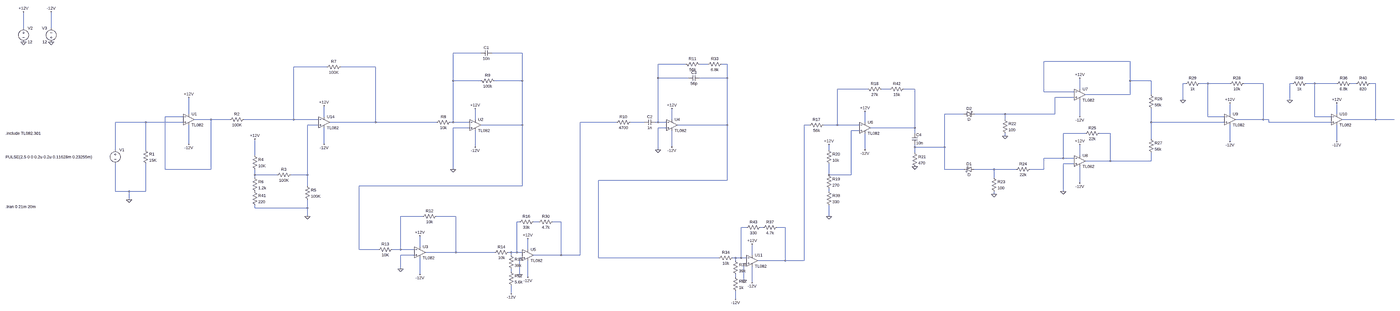
[diagram p0: schematic tp2.asc, whole sheet]
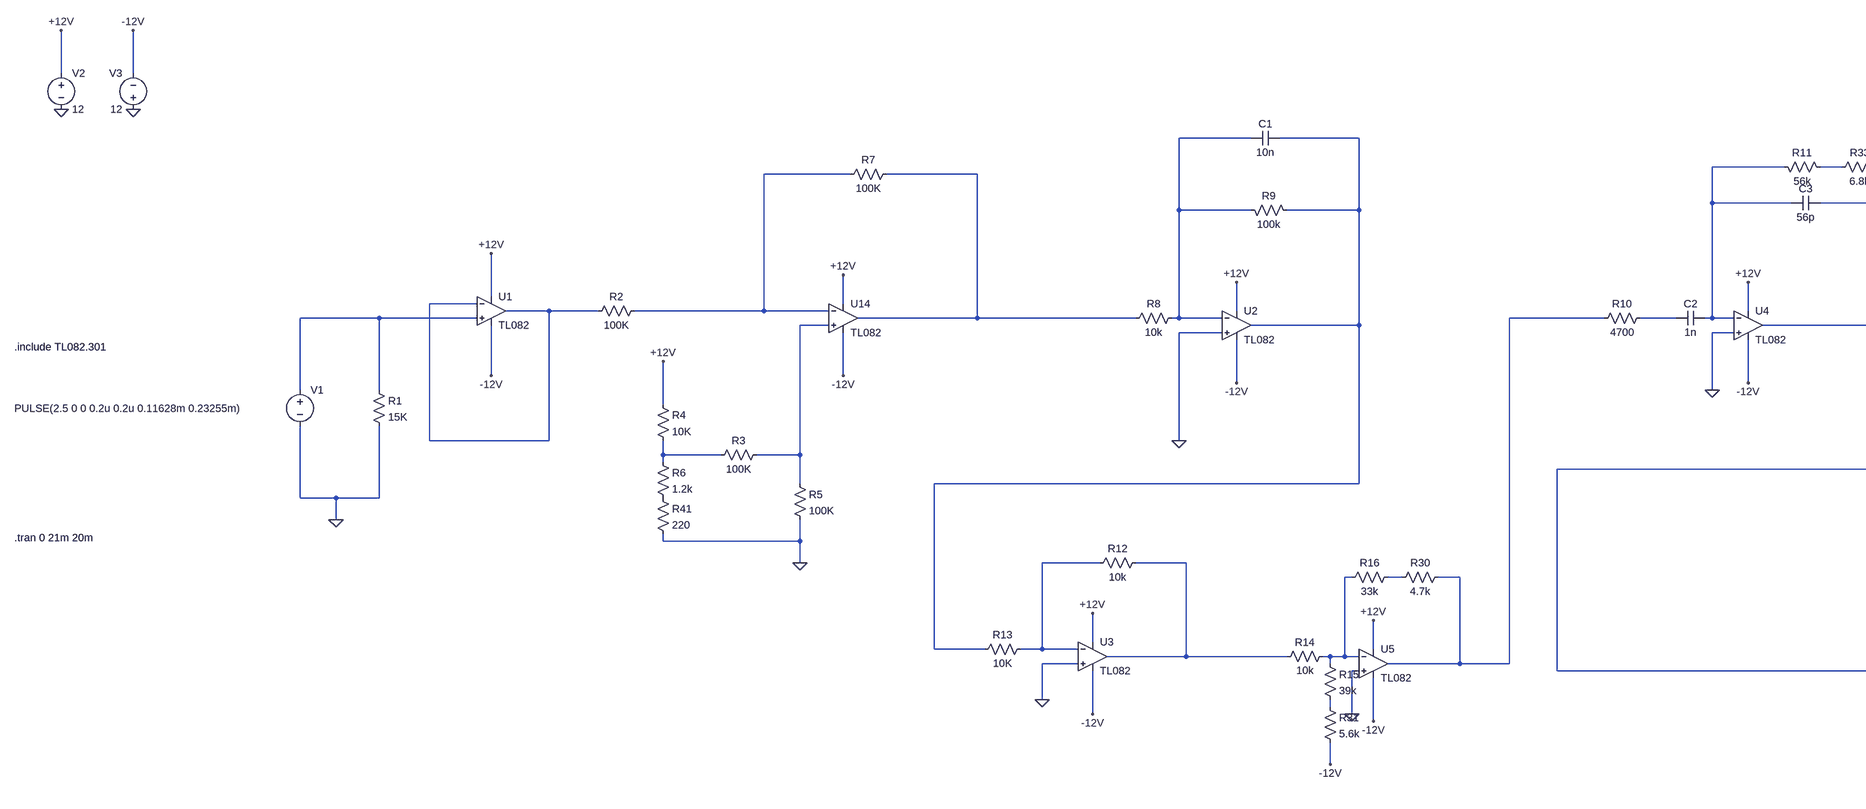
[diagram p1: schematic tp2.asc, part, row 1 of 1, column 1 of 2]
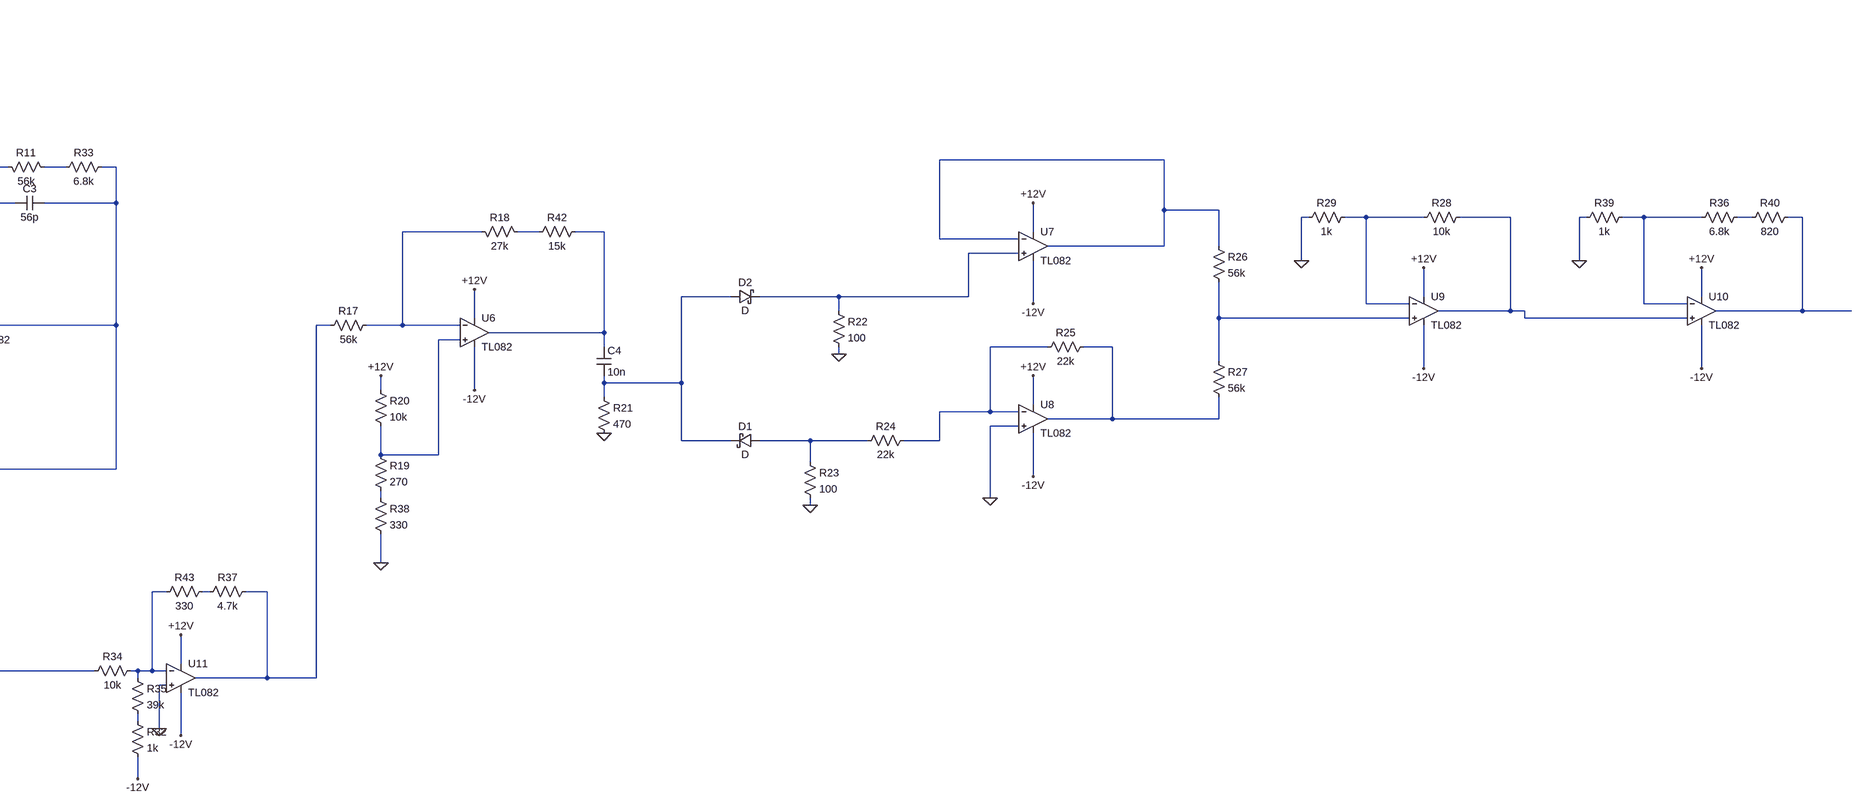
[diagram p2: schematic tp2.asc, part, row 1 of 1, column 2 of 2]
tp2.asc, the LTspice schematic file:
Version 4.1
SHEET 1 8932 1668
WIRE -1280 -384 -1280 -480
WIRE -1120 -384 -1120 -480
WIRE 1456 -240 1296 -240
WIRE 1696 -240 1520 -240
WIRE 5504 -192 4992 -192
WIRE 2816 -176 2656 -176
WIRE 2944 -176 2896 -176
WIRE 3056 -176 3024 -176
WIRE 544 -160 352 -160
WIRE 848 -160 624 -160
WIRE 2656 -96 2656 -176
WIRE 2832 -96 2656 -96
WIRE 3056 -96 3056 -176
WIRE 3056 -96 2896 -96
WIRE 1296 -80 1296 -240
WIRE 1456 -80 1296 -80
WIRE 1696 -80 1696 -240
WIRE 1696 -80 1536 -80
WIRE 5504 -80 5504 -192
WIRE 5648 -80 5504 -80
WIRE 5904 -64 5888 -64
WIRE 6032 -64 5984 -64
WIRE 6160 -64 6032 -64
WIRE 6384 -64 6240 -64
WIRE 6560 -64 6544 -64
WIRE 6688 -64 6640 -64
WIRE 6816 -64 6688 -64
WIRE 6928 -64 6896 -64
WIRE 7040 -64 7008 -64
WIRE 3872 -32 3696 -32
WIRE 4000 -32 3952 -32
WIRE 4144 -32 4080 -32
WIRE 5200 -32 5200 -96
WIRE 4992 -16 4992 -192
WIRE 5168 -16 4992 -16
WIRE 5504 0 5504 -80
WIRE 5504 0 5232 0
WIRE 5648 0 5648 -80
WIRE 5168 16 5056 16
WIRE 5888 32 5888 -64
WIRE 6544 32 6544 -64
WIRE -304 112 -304 16
WIRE 4528 112 4384 112
WIRE 4768 112 4592 112
WIRE 5056 112 5056 16
WIRE 5056 112 4768 112
WIRE 6160 112 6160 48
WIRE 6816 112 6816 48
WIRE -336 128 -448 128
WIRE 528 128 528 64
WIRE 5200 128 5200 32
WIRE 6032 128 6032 -64
WIRE 6128 128 6032 128
WIRE 6688 128 6688 -64
WIRE 6784 128 6688 128
WIRE -176 144 -272 144
WIRE -16 144 -176 144
WIRE 352 144 352 -160
WIRE 352 144 64 144
WIRE 496 144 352 144
WIRE 1424 144 1424 80
WIRE 2736 144 2736 80
WIRE 4768 144 4768 112
WIRE 6384 144 6384 -64
WIRE 6384 144 6192 144
WIRE 6416 144 6384 144
WIRE 7040 144 7040 -64
WIRE 7040 144 6848 144
WIRE 7168 144 7040 144
WIRE -560 160 -736 160
WIRE -336 160 -560 160
WIRE 848 160 848 -160
WIRE 848 160 560 160
WIRE 1200 160 848 160
WIRE 1296 160 1296 -80
WIRE 1296 160 1280 160
WIRE 1392 160 1296 160
WIRE 2416 160 2032 160
WIRE 2576 160 2496 160
WIRE 2656 160 2656 -96
WIRE 2656 160 2640 160
WIRE 2704 160 2656 160
WIRE 3856 160 3856 96
WIRE 5648 160 5648 80
WIRE 6128 160 5648 160
WIRE 6416 160 6416 144
WIRE 6784 160 6416 160
WIRE 496 176 432 176
WIRE 1696 176 1696 -80
WIRE 1696 176 1456 176
WIRE 3056 176 3056 -96
WIRE 3056 176 2768 176
WIRE 3536 176 3504 176
WIRE 3696 176 3696 -32
WIRE 3696 176 3616 176
WIRE 3824 176 3696 176
WIRE 1392 192 1296 192
WIRE 2704 192 2656 192
WIRE 4144 192 4144 -32
WIRE 4144 192 3888 192
WIRE 3824 208 3776 208
WIRE 4144 224 4144 192
WIRE 5232 224 5104 224
WIRE 5376 224 5312 224
WIRE 4768 240 4768 224
WIRE 5648 256 5648 160
WIRE 6160 272 6160 176
WIRE 6816 272 6816 176
WIRE -304 288 -304 176
WIRE 528 288 528 192
WIRE 1424 304 1424 208
WIRE 2736 304 2736 208
WIRE 4144 304 4144 288
WIRE 4384 304 4384 112
WIRE 4384 304 4144 304
WIRE -736 320 -736 160
WIRE -560 320 -560 160
WIRE 2656 320 2656 192
WIRE 3648 320 3648 288
WIRE 3856 320 3856 224
WIRE 4144 336 4144 304
WIRE 128 352 128 256
WIRE 5200 352 5200 288
WIRE 5104 368 5104 224
WIRE 5104 368 4992 368
WIRE 5168 368 5104 368
WIRE 5376 384 5376 224
WIRE 5376 384 5232 384
WIRE 5648 384 5648 336
WIRE 5648 384 5376 384
WIRE 5168 400 5104 400
WIRE -448 432 -448 128
WIRE -176 432 -176 144
WIRE -176 432 -448 432
WIRE 1296 432 1296 192
WIRE 4384 432 4384 304
WIRE 4528 432 4384 432
WIRE 4704 432 4592 432
WIRE 4832 432 4704 432
WIRE 4992 432 4992 368
WIRE 4992 432 4912 432
WIRE 128 464 128 432
WIRE 256 464 128 464
WIRE 432 464 432 176
WIRE 432 464 336 464
WIRE 3648 464 3648 400
WIRE 3776 464 3776 208
WIRE 3776 464 3648 464
WIRE 128 480 128 464
WIRE 4704 480 4704 432
WIRE 3056 496 3056 176
WIRE 3056 496 2256 496
WIRE 5200 512 5200 416
WIRE 432 528 432 464
WIRE 1696 528 1696 176
WIRE 1696 528 752 528
WIRE -736 560 -736 400
WIRE -656 560 -736 560
WIRE -560 560 -560 400
WIRE -560 560 -656 560
WIRE 3648 560 3648 544
WIRE 5104 560 5104 400
WIRE 4704 576 4704 560
WIRE -656 608 -656 560
WIRE 128 656 128 640
WIRE 432 656 432 608
WIRE 432 656 128 656
WIRE 432 704 432 656
WIRE 1120 704 992 704
WIRE 1312 704 1200 704
WIRE 3648 704 3648 640
WIRE 1680 736 1664 736
WIRE 1792 736 1760 736
WIRE 1920 736 1872 736
WIRE 3168 768 3136 768
WIRE 3264 768 3248 768
WIRE 3392 768 3344 768
WIRE 1104 880 1104 816
WIRE 752 896 752 528
WIRE 864 896 752 896
WIRE 992 896 992 704
WIRE 992 896 944 896
WIRE 1072 896 992 896
WIRE 1728 896 1728 832
WIRE 1312 912 1312 704
WIRE 1312 912 1136 912
WIRE 1536 912 1312 912
WIRE 1632 912 1616 912
WIRE 1664 912 1664 736
WIRE 1664 912 1632 912
WIRE 1696 912 1664 912
WIRE 1072 928 992 928
WIRE 1632 928 1632 912
WIRE 1920 928 1920 736
WIRE 1920 928 1760 928
WIRE 2032 928 2032 160
WIRE 2032 928 1920 928
WIRE 3200 928 3200 864
WIRE 1696 944 1680 944
WIRE 2256 944 2256 496
WIRE 3008 944 2256 944
WIRE 3104 944 3088 944
WIRE 3136 944 3136 768
WIRE 3136 944 3104 944
WIRE 3168 944 3136 944
WIRE 3104 960 3104 944
WIRE 3392 960 3392 768
WIRE 3392 960 3232 960
WIRE 3504 960 3504 176
WIRE 3504 960 3392 960
WIRE 3168 976 3152 976
WIRE 992 1008 992 928
WIRE 1632 1024 1632 1008
WIRE 1104 1040 1104 944
WIRE 1680 1040 1680 944
WIRE 1728 1056 1728 960
WIRE 3104 1056 3104 1040
WIRE 3152 1072 3152 976
WIRE 3200 1088 3200 992
WIRE 1632 1152 1632 1104
WIRE 3104 1184 3104 1136
FLAG -1280 -304 0
FLAG -1120 -304 0
FLAG -1120 -480 -12V
FLAG -1280 -480 +12V
FLAG -304 16 +12V
FLAG -304 288 -12V
FLAG 528 64 +12V
FLAG 528 288 -12V
FLAG 432 704 0
FLAG 128 256 +12V
FLAG 1424 80 +12V
FLAG 1424 304 -12V
FLAG 1296 432 0
FLAG 2736 80 +12V
FLAG 2736 304 -12V
FLAG 3856 96 +12V
FLAG 3856 320 -12V
FLAG 3648 288 +12V
FLAG 3648 704 0
FLAG 4144 416 0
FLAG 4768 240 0
FLAG 4704 576 0
FLAG 5200 -96 +12V
FLAG 5200 128 -12V
FLAG 5200 288 +12V
FLAG 5200 512 -12V
FLAG 5104 560 0
FLAG 6160 48 +12V
FLAG 6160 272 -12V
FLAG 5888 32 0
FLAG 1104 816 +12V
FLAG 1104 1040 -12V
FLAG 992 1008 0
FLAG 1728 832 +12V
FLAG 1728 1056 -12V
FLAG 1680 1040 0
FLAG 1632 1152 -12V
FLAG 3200 864 +12V
FLAG 3200 1088 -12V
FLAG 3152 1072 0
FLAG 3104 1184 -12V
FLAG 2656 320 0
FLAG 6816 48 +12V
FLAG 6816 272 -12V
FLAG 6544 32 0
FLAG -656 608 0
SYMBOL voltage -736 304 R0
WINDOW 3 -648 57 Left 2
WINDOW 123 0 0 Left 0
WINDOW 39 0 0 Left 0
SYMATTR Value PULSE(2.5 0 0 0.2u 0.2u 0.11628m 0.23255m)
SYMATTR InstName V1
SYMBOL voltage -1280 -400 R0
SYMATTR InstName V2
SYMATTR Value 12
SYMBOL voltage -1120 -288 R180
WINDOW 0 24 96 Left 2
WINDOW 3 24 16 Left 2
SYMATTR InstName V3
SYMATTR Value 12
SYMBOL res -576 304 R0
SYMATTR InstName R1
SYMATTR Value 15K
SYMBOL res 80 128 R90
WINDOW 0 0 56 VBottom 2
WINDOW 3 32 56 VTop 2
SYMATTR InstName R2
SYMATTR Value 100K
SYMBOL res 352 448 R90
WINDOW 0 0 56 VBottom 2
WINDOW 3 32 56 VTop 2
SYMATTR InstName R3
SYMATTR Value 100K
SYMBOL res 112 336 R0
SYMATTR InstName R4
SYMATTR Value 10K
SYMBOL res 416 512 R0
SYMATTR InstName R5
SYMATTR Value 100K
SYMBOL res 112 464 R0
SYMATTR InstName R6
SYMATTR Value 1.2k
SYMBOL res 640 -176 R90
WINDOW 0 0 56 VBottom 2
WINDOW 3 32 56 VTop 2
SYMATTR InstName R7
SYMATTR Value 100K
SYMBOL res 1296 144 R90
WINDOW 0 0 56 VBottom 2
WINDOW 3 32 56 VTop 2
SYMATTR InstName R8
SYMATTR Value 10k
SYMBOL res 1440 -96 M90
WINDOW 0 0 56 VBottom 2
WINDOW 3 32 56 VTop 2
SYMATTR InstName R9
SYMATTR Value 100k
SYMBOL cap 1456 -224 R270
WINDOW 0 32 32 VTop 2
WINDOW 3 0 32 VBottom 2
SYMATTR InstName C1
SYMATTR Value 10n
SYMBOL res 2512 144 R90
WINDOW 0 0 56 VBottom 2
WINDOW 3 32 56 VTop 2
SYMATTR InstName R10
SYMATTR Value 4700
SYMBOL cap 2640 144 R90
WINDOW 0 0 32 VBottom 2
WINDOW 3 32 32 VTop 2
SYMATTR InstName C2
SYMATTR Value 1n
SYMBOL res 2800 -192 M90
WINDOW 0 0 56 VBottom 2
WINDOW 3 32 56 VTop 2
SYMATTR InstName R11
SYMATTR Value 56k
SYMBOL cap 2896 -112 R90
WINDOW 0 0 32 VBottom 2
WINDOW 3 32 32 VTop 2
SYMATTR InstName C3
SYMATTR Value 56p
SYMBOL res 3632 160 R90
WINDOW 0 0 56 VBottom 2
WINDOW 3 32 56 VTop 2
SYMATTR InstName R17
SYMATTR Value 56k
SYMBOL res 3856 -48 M90
WINDOW 0 0 56 VBottom 2
WINDOW 3 32 56 VTop 2
SYMATTR InstName R18
SYMATTR Value 27k
SYMBOL res 3632 448 R0
SYMATTR InstName R19
SYMATTR Value 270
SYMBOL res 3632 304 R0
SYMATTR InstName R20
SYMATTR Value 10k
SYMBOL cap 4128 224 R0
SYMATTR InstName C4
SYMATTR Value 10n
SYMBOL res 4128 320 R0
SYMATTR InstName R21
SYMATTR Value 470
SYMBOL schottky 4592 416 R90
WINDOW 0 0 32 VBottom 2
WINDOW 3 32 32 VTop 2
SYMATTR InstName D1
SYMBOL schottky 4528 128 R270
WINDOW 0 32 32 VTop 2
WINDOW 3 0 32 VBottom 2
SYMATTR InstName D2
SYMBOL res 4752 128 R0
SYMATTR InstName R22
SYMATTR Value 100
SYMBOL res 4688 464 R0
SYMATTR InstName R23
SYMATTR Value 100
SYMBOL res 4928 416 R90
WINDOW 0 0 56 VBottom 2
WINDOW 3 32 56 VTop 2
SYMATTR InstName R24
SYMATTR Value 22k
SYMBOL res 5328 208 R90
WINDOW 0 0 56 VBottom 2
WINDOW 3 32 56 VTop 2
SYMATTR InstName R25
SYMATTR Value 22k
SYMBOL res 5632 -16 R0
SYMATTR InstName R26
SYMATTR Value 56k
SYMBOL res 5632 240 R0
SYMATTR InstName R27
SYMATTR Value 56k
SYMBOL res 6256 -80 R90
WINDOW 0 0 56 VBottom 2
WINDOW 3 32 56 VTop 2
SYMATTR InstName R28
SYMATTR Value 10k
SYMBOL res 6000 -80 R90
WINDOW 0 0 56 VBottom 2
WINDOW 3 32 56 VTop 2
SYMATTR InstName R29
SYMATTR Value 1k
SYMBOL res 1216 688 R90
WINDOW 0 0 56 VBottom 2
WINDOW 3 32 56 VTop 2
SYMATTR InstName R12
SYMATTR Value 10k
SYMBOL res 848 912 R270
WINDOW 0 32 56 VTop 2
WINDOW 3 0 56 VBottom 2
SYMATTR InstName R13
SYMATTR Value 10K
SYMBOL res 1632 896 R90
WINDOW 0 0 56 VBottom 2
WINDOW 3 32 56 VTop 2
SYMATTR InstName R14
SYMATTR Value 10k
SYMBOL res 1616 912 R0
SYMATTR InstName R15
SYMATTR Value 39k
SYMBOL res 1776 720 R90
WINDOW 0 0 56 VBottom 2
WINDOW 3 32 56 VTop 2
SYMATTR InstName R16
SYMATTR Value 33k
SYMBOL res 1616 1008 R0
SYMATTR InstName R31
SYMATTR Value 5.6k
SYMBOL res 3104 928 R90
WINDOW 0 0 56 VBottom 2
WINDOW 3 32 56 VTop 2
SYMATTR InstName R34
SYMATTR Value 10k
SYMBOL res 3088 944 R0
SYMATTR InstName R35
SYMATTR Value 39k
SYMBOL res 3360 752 R90
WINDOW 0 0 56 VBottom 2
WINDOW 3 32 56 VTop 2
SYMATTR InstName R37
SYMATTR Value 4.7k
SYMBOL res 6912 -80 R90
WINDOW 0 0 56 VBottom 2
WINDOW 3 32 56 VTop 2
SYMATTR InstName R36
SYMATTR Value 6.8k
SYMBOL res 6656 -80 R90
WINDOW 0 0 56 VBottom 2
WINDOW 3 32 56 VTop 2
SYMATTR InstName R39
SYMATTR Value 1k
SYMBOL res 112 544 R0
SYMATTR InstName R41
SYMATTR Value 220
SYMBOL OpAmps\\opamp2 528 96 R0
SYMATTR InstName U14
SYMATTR Value TL082
SYMBOL OpAmps\\opamp2 -304 80 R0
SYMATTR InstName U1
SYMATTR Value TL082
SYMBOL OpAmps\\opamp2 1424 112 R0
SYMATTR InstName U2
SYMATTR Value TL082
SYMBOL OpAmps\\opamp2 1104 848 R0
SYMATTR InstName U3
SYMATTR Value TL082
SYMBOL OpAmps\\opamp2 1728 864 R0
SYMATTR InstName U5
SYMATTR Value TL082
SYMBOL res 1888 720 R90
WINDOW 0 0 56 VBottom 2
WINDOW 3 32 56 VTop 2
SYMATTR InstName R30
SYMATTR Value 4.7k
SYMBOL OpAmps\\opamp2 2736 112 R0
SYMATTR InstName U4
SYMATTR Value TL082
SYMBOL OpAmps\\opamp2 3200 896 R0
SYMATTR InstName U11
SYMATTR Value TL082
SYMBOL OpAmps\\opamp2 3856 128 R0
SYMATTR InstName U6
SYMATTR Value TL082
SYMBOL OpAmps\\opamp2 5200 -64 R0
SYMATTR InstName U7
SYMATTR Value TL082
SYMBOL OpAmps\\opamp2 5200 320 R0
SYMATTR InstName U8
SYMATTR Value TL082
SYMBOL OpAmps\\opamp2 6160 80 R0
SYMATTR InstName U9
SYMATTR Value TL082
SYMBOL res 3088 1040 R0
SYMATTR InstName R32
SYMATTR Value 1k
SYMBOL OpAmps\\opamp2 6816 80 R0
SYMATTR InstName U10
SYMATTR Value TL082
SYMBOL res 3040 -192 R90
WINDOW 0 0 56 VBottom 2
WINDOW 3 32 56 VTop 2
SYMATTR InstName R33
SYMATTR Value 6.8k
SYMBOL res 3632 544 R0
SYMATTR InstName R38
SYMATTR Value 330
SYMBOL res 7024 -80 R90
WINDOW 0 0 56 VBottom 2
WINDOW 3 32 56 VTop 2
SYMATTR InstName R40
SYMATTR Value 820
SYMBOL res 4096 -48 R90
WINDOW 0 0 56 VBottom 2
WINDOW 3 32 56 VTop 2
SYMATTR InstName R42
SYMATTR Value 15k
SYMBOL res 3264 752 R90
WINDOW 0 0 56 VBottom 2
WINDOW 3 32 56 VTop 2
SYMATTR InstName R43
SYMATTR Value 330
TEXT -1384 648 Left 2 !.tran 0 21m 20m
TEXT -1384 224 Left 2 !.include TL082.301

The netlist it stands for:
* tp2.asc
V1 N020 0 PULSE(2.5 0 0 0.2u 0.2u 0.11628m 0.23255m)
V2 +12V 0 12
V3 0 -12V 12
R1 N020 0 15K
R2 N007 N019 100K
R3 N024 N030 100K
R4 +12V N030 10K
R5 N024 0 100K
R6 N030 P001 1.2k
R7 N008 N007 100K
R8 N001 N008 10k
R9 N001 N002 100k
C1 N001 N002 10n
R10 N022 N021 4700
C2 N004 N022 1n
R11 N004 N005 56k
C3 N006 N004 56p
R17 N014 N025 56k
R18 N014 N015 27k
R19 N026 N031 270
R20 +12V N026 10k
C4 N016 N018 10n
R21 N018 0 470
D1 N029 N018 D
D2 N018 N017 D
R22 N017 0 100
R23 N029 0 100
R24 N027 N029 22k
R25 N028 N027 22k
R26 N003 N023 56k
R27 N023 N028 56k
R28 N010 N009 10k
R29 N009 0 1k
R12 N033 N032 10k
R13 N002 N032 10K
R14 N034 N033 10k
R15 N034 N038 39k
R16 N035 N034 33k
R31 N038 -12V 5.6k
R34 N036 N006 10k
R35 N036 N039 39k
R37 N025 N037 4.7k
R36 N012 N011 6.8k
R39 N011 0 1k
R41 P001 0 220
X§U14 N024 N007 +12V -12V N008 TL082  ; pins In+ In- V+ V- OUT
X§U1 N020 N019 +12V -12V N019 TL082  ; pins In+ In- V+ V- OUT
X§U2 0 N001 +12V -12V N002 TL082  ; pins In+ In- V+ V- OUT
X§U3 0 N032 +12V -12V N033 TL082  ; pins In+ In- V+ V- OUT
X§U5 0 N034 +12V -12V N021 TL082  ; pins In+ In- V+ V- OUT
R30 N021 N035 4.7k
X§U4 0 N004 +12V -12V N006 TL082  ; pins In+ In- V+ V- OUT
X§U11 0 N036 +12V -12V N025 TL082  ; pins In+ In- V+ V- OUT
X§U6 N026 N014 +12V -12V N016 TL082  ; pins In+ In- V+ V- OUT
X§U7 N017 N003 +12V -12V N003 TL082  ; pins In+ In- V+ V- OUT
X§U8 0 N027 +12V -12V N028 TL082  ; pins In+ In- V+ V- OUT
X§U9 N023 N009 +12V -12V N010 TL082  ; pins In+ In- V+ V- OUT
R32 N039 -12V 1k
X§U10 N010 N011 +12V -12V N013 TL082  ; pins In+ In- V+ V- OUT
R33 N006 N005 6.8k
R38 N031 0 330
R40 N013 N012 820
R42 N016 N015 15k
R43 N037 N036 330
.model D D
.lib standard.dio
.tran 0 21m 20m
.include TL082.301
.backanno
.end